# Altium schematic sheet quadrupe.SchDoc
size A3
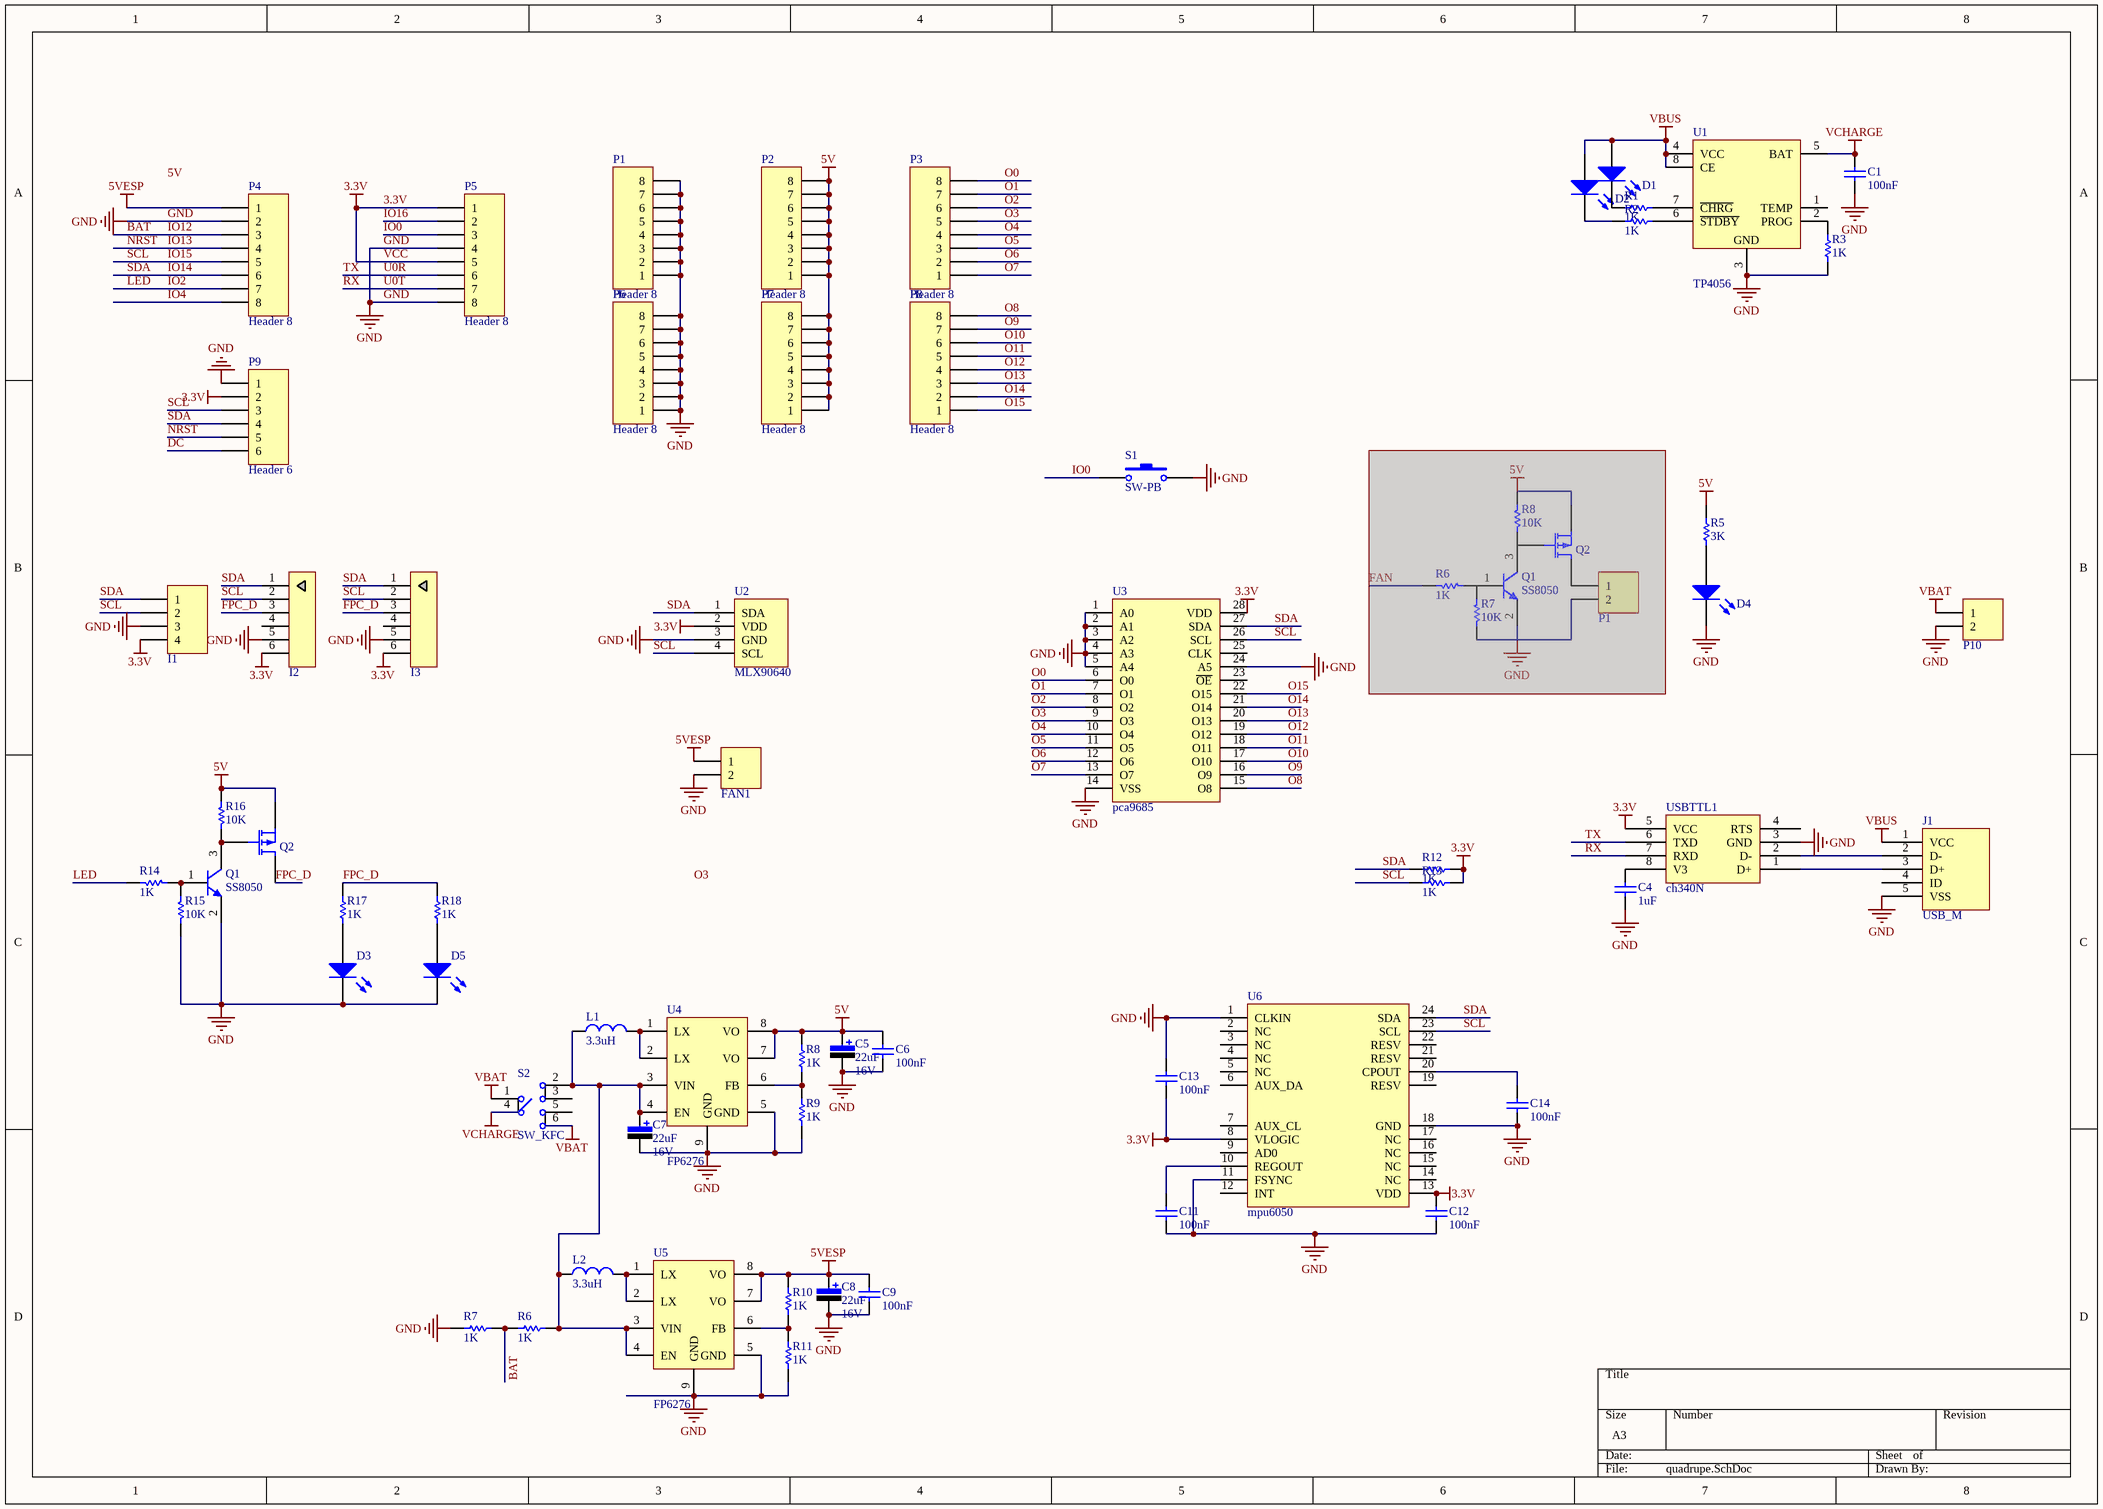
[diagram p0: quadrupe.SchDoc]

## Parts
(Parts that share a designator on the sheet are numbered #1, #2 ... from top to bottom, then left to right.)
C1  value 100nF  [C-RAD-0603]  (hidden comment: Cap)
C4  value 1uF  [C-RAD-0603]  (hidden comment: Cap)
C5  value 22uF  Vol: 16V  [C-RB-8]  (hidden comment: Cap Pol)
C6  value 100nF  [C-RAD-0603]  (hidden comment: Cap)
C7  value 22uF  Vol: 16V  [C-RB-10]  (hidden comment: Cap Pol)
C8  value 22uF  Vol: 16V  [C-RB-8]  (hidden comment: Cap Pol)
C9  value 100nF  [C-RAD-0603]  (hidden comment: Cap)
C11  value 100nF  [C-RAD-0603]  (hidden comment: Cap)
C12  value 100nF  [C-RAD-0603]  (hidden comment: Cap)
C13  value 100nF  [C-RAD-0603]  (hidden comment: Cap)
C14  value 100nF  [C-RAD-0603]  (hidden comment: Cap)
D1  LED0  [0603-LED]  (value not drawn)
D2  LED0  [0603-LED]  (value not drawn)
D3  LED0  [LED_A2]  (value not drawn)
D4  LED0  [0603-LED]  (value not drawn)
D5  LED0  [LED_A2]  (value not drawn)
FAN1  Header 2  [HDR2X1_B1]  (value not drawn)
I1  Header 4  [HDR4X1_A]  (value not drawn)
I2  FPC  [FPC1.0-6P-A]  (value not drawn)
I3  FPC  [FPC1.0-6P-A]  (value not drawn)
J1  USB_M  [USB_MICRO - 4leg]
L1  value 3.3uH  [L-SMD-5]  (hidden comment: Inductor)
L2  value 3.3uH  [L-SMD-5]  (hidden comment: Inductor)
P1#1  Header 8  [HDR8_A1]
P1#2  Header 2  [HDR2X1_B1]  (value not drawn)  (masked out: inside a compile mask, not in the netlist)
P2  Header 8  [HDR8_A1]
P3  Header 8  [HDR8_A1]
P4  Header 8  [HDR1X8]
P5  Header 8  [HDR1X8]
P6  Header 8  [HDR8_A1]
P7  Header 8  [HDR8_A1]
P8  Header 8  [HDR8_A1]
P9  Header 6  [HDR1X6]
P10  Header 2  [HDR2X1_A]  (value not drawn)
Q1#1  SS8050  [SOT-23]  (masked out: inside a compile mask, not in the netlist)
Q1#2  SS8050  [SOT-23]
Q2#1  MOSFET-P  [SOT-23 - MOS]  (value not drawn)  (masked out: inside a compile mask, not in the netlist)
Q2#2  MOSFET-P  [SOT-23 - MOS]  (value not drawn)
R1  value 1K  [0603-1]  (hidden comment: Res1)
R2  value 1K  [0603-1]  (hidden comment: Res1)
R3  value 1K  [0603-1]  (hidden comment: Res1)
R5  value 3K  [0603-1]  (hidden comment: Res1)
R6#1  value 1K  [0603-1]  (hidden comment: Res1)  (masked out: inside a compile mask, not in the netlist)
R6#2  value 1K  [0603-1]  (hidden comment: Res1)
R7#1  value 10K  [0603-1]  (hidden comment: Res1)  (masked out: inside a compile mask, not in the netlist)
R7#2  value 1K  [0603-1]  (hidden comment: Res1)
R8#1  value 10K  [0603-1]  (hidden comment: Res1)  (masked out: inside a compile mask, not in the netlist)
R8#2  value 1K  [0603-1]  (hidden comment: Res1)
R9  value 1K  [0603-1]  (hidden comment: Res1)
R10  value 1K  [0603-1]  (hidden comment: Res1)
R11  value 1K  [0603-1]  (hidden comment: Res1)
R12  value 1K  [0603-1]  (hidden comment: Res1)
R13  value 1K  [0603-1]  (hidden comment: Res1)
R14  value 1K  [0603-1]  (hidden comment: Res1)
R15  value 10K  [0603-1]  (hidden comment: Res1)
R16  value 10K  [0603-1]  (hidden comment: Res1)
R17  value 1K  [0603-1]  (hidden comment: Res1)
R18  value 1K  [0603-1]  (hidden comment: Res1)
S1  SW-PB  [SW_PB2_3*5]
S2  SW_KFC  [SW-KFC]
U1  TP4056  [NSO8_TP4056]
U2  MLX90640  [MLX90640]
U3  pca9685  [SSOP-28]
U4  FP6276  [SOP-8N - 9pad - max]
U5  FP6276  [SOP-8N - 9pad - max]
U6  mpu6050  [QFN50P400X400X80_HS-25N]
USBTTL1  ch340N  [SOP-8N]

## Nets
3.3V: C12.2 C13.1 I1.4 I2.6 I3.6 P5.1 P5.5 P9.2 R12.1 R13.1 U2.2(VDD) U3.28(VDD) U6.8(VLOGIC) U6.13(VDD) USBTTL1.5(VCC)  [also labelled VCC]
5V: C5.1 C6.2 P2.1 P2.2 P2.3 P2.4 P2.5 P2.6 P2.7 P2.8 P7.1 P7.2 P7.3 P7.4 P7.5 P7.6 P7.7 P7.8 Q2#2.S R5.2 R8#2.2 R16.1 U4.7(VO) U4.8(VO)
5VESP: C8.1 C9.2 FAN1.1 P4.1 R10.2 U5.7(VO) U5.8(VO)
GND: C1.1 C4.1 C5.2 C6.1 C7.2 C8.2 C9.1 C11.1 C12.1 C13.2 C14.1 D3.2(K) D4.2(K) D5.2(K) FAN1.2 I1.3 I2.5 I3.5 J1.5(VSS) P1#1.1 P1#1.2 P1#1.3 P1#1.4 P1#1.5 P1#1.6 P1#1.7 P1#1.8 P4.2 P5.4 P5.8 P6.1 P6.2 P6.3 P6.4 P6.5 P6.6 P6.7 P6.8 P9.1 P10.2 Q1#2.2(E) R3.1 R7#2.1 R9.1 R11.1 R15.2 S1.2 U1.3(GND) U2.3(GND) U3.1(A0) U3.2(A1) U3.3(A2) U3.4(A3) U3.5(A4) U3.14(VSS) U3.24(A5) U4.5(GND) U4.9(GND) U5.5(GND) U5.9(GND) U6.1(CLKIN) U6.11(FSYNC) U6.18(GND) USBTTL1.3(GND)
VBAT: P10.1 S2.1 S2.6
VBUS: D1.1(A) D2.1(A) J1.1(VCC) U1.4(VCC) U1.8(CE)
VCHARGE: C1.2 S2.4 U1.5(BAT)
BAT: P4.3 R6#2.1 R7#2.2  [also labelled IO12]
DC: P9.6
FPC_D: I2.3 I3.3 Q2#2.D R17.2 R18.2
IO0: P5.3 S1.1
IO2: P4.7 R14.1  [also labelled LED]
IO4: P4.8
IO13: P4.4 P9.5  [also labelled NRST]
IO14: I1.1 I2.1 I3.1 P4.6 P9.4 R12.2 U2.1(SDA) U3.27(SDA) U6.24(SDA)  [also labelled SDA]
IO15: I1.2 I2.2 I3.2 P4.5 P9.3 R13.2 U2.4(SCL) U3.26(SCL) U6.23(SCL)  [also labelled SCL]
IO16: P5.2
O0: P3.8 U3.6(O0)
O1: P3.7 U3.7(O1)
O2: P3.6 U3.8(O2)
O3: P3.5 U3.9(O3)
O4: P3.4 U3.10(O4)
O5: P3.3 U3.11(O5)
O6: P3.2 U3.12(O6)
O7: P3.1 U3.13(O7)
O8: P8.8 U3.15(O8)
O9: P8.7 U3.16(O9)
O10: P8.6 U3.17(O10)
O11: P8.5 U3.18(O11)
O12: P8.4 U3.19(O12)
O13: P8.3 U3.20(O13)
O14: P8.2 U3.21(O14)
O15: P8.1 U3.22(O15)
RX: P5.7 USBTTL1.7(RXD)  [also labelled U0T]
TX: P5.6 USBTTL1.6(TXD)  [also labelled U0R]
NetC4_2: C4.2 USBTTL1.8(V3)
NetC7_1: C7.1 L1.1 L2.1 R6#2.2 S2.2 U4.3(VIN) U4.4(EN) U5.3(VIN) U5.4(EN)
NetC11_2: C11.2 U6.10(REGOUT)
NetC14_2: C14.2 U6.20(CPOUT)
NetD1_2: D1.2(K) R1.1
NetD2_2: D2.2(K) R2.1
NetD3_1: D3.1(A) R17.1
NetD4_1: D4.1(A) R5.1
NetD5_1: D5.1(A) R18.1
NetJ1_2: J1.2(D-) USBTTL1.2(D-)
NetJ1_3: J1.3(D+) USBTTL1.1(D+)
NetL1_2: L1.2 U4.1(LX) U4.2(LX)
NetL2_2: L2.2 U5.1(LX) U5.2(LX)
NetQ1#2_1: Q1#2.1(B) R14.2 R15.1
NetQ1#2_3: Q1#2.3(C) Q2#2.G R16.2
NetR1_2: R1.2 U1.7(~{CHRG})
NetR2_2: R2.2 U1.6(~{STDBY})
NetR3_2: R3.2 U1.2(PROG)
NetR8#2_1: R8#2.1 R9.2 U4.6(FB)
NetR10_1: R10.1 R11.2 U5.6(FB)

Not connected (* = marked no-connect by the designer): I2 4; I3 4; J1 4(ID); S2 3 5; U1 1(TEMP); U3 23(~{OE}) 25(CLK); U6 2(NC) 3(NC) 4(NC) 5(NC) 6(AUX_DA) 7(AUX_CL) 9(AD0) 12(INT) 14(NC) 15(NC) 16(NC) 17(NC) 19(RESV) 21(RESV) 22(RESV); USBTTL1 4(RTS)

## Notes on the sheet
- Labels drawn without touching a wire or pin: 5V, O3

## Library data of the parts
C1 C4 C6 C9 C11-C14 = Cap: 无极性电容; Published: 8-Jun-2000; LatestRevisionDate: 17-Jul-2002; LatestRevisionNote: Re-released for DXP Platform.; PackageReference: RAD-0.3; Publisher: Altium Limited
C5 C7 C8 = Cap Pol: 极性电解电容; Published: 8-Jun-2000; LatestRevisionDate: 17-Jul-2002; LatestRevisionNote: Re-released for DXP Platform.; PackageReference: RB7.6-15; Publisher: Altium Limited
D1-D5 = LED0: 发光二极管; Published: 8-Jun-2000; LatestRevisionDate: 08-Jul-2005; LatestRevisionNote: Mech Layer 1 removed.; PackageReference: LED-0; Publisher: Altium Limited
FAN1 P1#2 P10 = Header 2: 接插件; LatestRevisionDate: 17-Jul-2002; LatestRevisionNote: Re-released for DXP Platform.; Publisher: Altium Limited
I1 = Header 4: 接插件; LatestRevisionDate: 17-Jul-2002; LatestRevisionNote: Re-released for DXP Platform.; Publisher: Altium Limited
I2 I3 = FPC-6P: FPC排线连接器
J1 = USB_M: MicroUSB接口
L1 L2 = Inductor: 电感; Code_IEC: 1005; Published: 8-Jun-2000; LatestRevisionDate: 17-Jul-2002; LatestRevisionNote: Re-released for DXP Platform.; PackageReference: 0402-A; Publisher: Altium Limited; Code_JEITA: 0402
P1#1 P2-P8 = Header 8: Header, 8-Pin; LatestRevisionDate: 17-Jul-2002; LatestRevisionNote: Re-released for DXP Platform.; Publisher: Altium Limited
P9 = Header 6: Header, 6-Pin; LatestRevisionDate: 17-Jul-2002; LatestRevisionNote: Re-released for DXP Platform.; Publisher: Altium Limited
Q1#1 Q1#2 = SS8050: NPN贴片三极管; Published: 8-Jun-2000; LatestRevisionDate: 15-Jan-2003; LatestRevisionNote: PCB Footprint 'BCY-W3/D4.7' replaced; DatasheetDocument: 1997; PackageDocument: Sep-1998; PackageReference: TO-92A; Publisher: Altium Limited; Code_JEDEC: TO-92A; ComponentLink1Description: Manufacturer Link; ComponentLink1URL: http://www.fairchildsemi.com/; ComponentLink2Description: Datasheet; ComponentLink2URL: http://www.fairchildsemi.com/ds/2N%2F2N3904.pdf
Q2#1 Q2#2 = MOSFET-P: P-Channel MOSFET; PackageDocument: 1995/1996; Published: 8-Jun-2000; LatestRevisionDate: 17-Jul-2002; LatestRevisionNote: Re-released for DXP Platform.; PackageReference: E3; Publisher: Altium Limited
R1-R3 R5 R6#1 R6#2 R7#1 R7#2 R8#1 R8#2 R9-R18 = Res1: 贴片电阻; Published: 8-Jun-2000; LatestRevisionDate: 17-Jul-2002; LatestRevisionNote: Re-released for DXP Platform.; PackageReference: AXIAL-0.4; Publisher: Altium Limited
S1 = SW-PB: 微动开关; Published: 24-Mar-1999; LatestRevisionDate: 17-Jul-2002; LatestRevisionNote: Re-released for DXP Platform.; PackageReference: SPST-2; Publisher: Altium Limited
S2 = SW_KFC: 自锁开关 侧卧
U1 = TP4056: 锂电池充电管理
U2 = MLX90640: 红外热传感器
U3 = pca9685: i2c多路pwm控制
USBTTL1 = ch340N: 串口转USB芯片